# EAGLE design trololo (EAGLE 6.5.0)
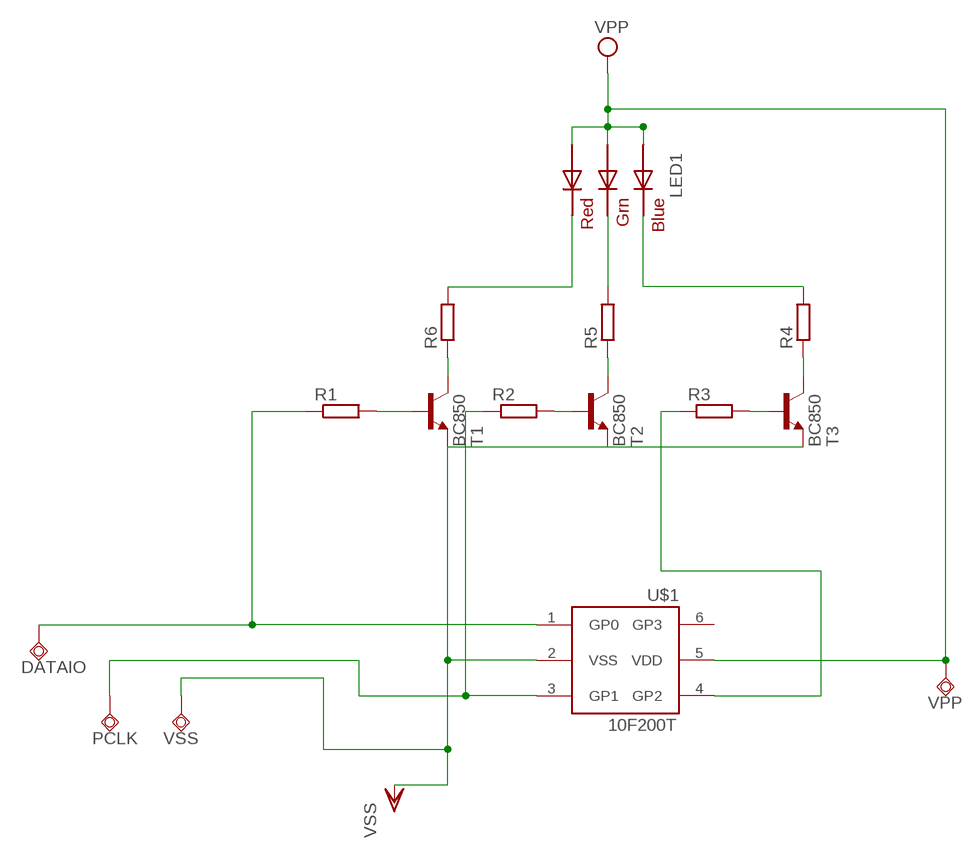
[diagram p0: schematic, sheet 1]

## Parts
DATAIO  TPSQPAD1-20Y  [P1-20Y]
LED1  RGBLED5050  [RGBLED5050]
PCLK  TPSQPAD1-20Y  [P1-20Y]
R1  R-EU_R0805  [R0805]
R2  R-EU_R0805  [R0805]
R3  R-EU_R0805  [R0805]
R4  R-EU_R0805  [R0805]
R5  R-EU_R0805  [R0805]
R6  R-EU_R0805  [R0805]
T1  BC850  [SOT23]
T2  BC850  [SOT23]
T3  BC850  [SOT23]
U$1  10F200T  [SOT23-6]
VPP  TPSQPAD1-20Y  [P1-20Y]
VSS  TPSQPAD1-20Y  [P1-20Y]

## Nets
N$1: R5.1 T2.3(C)
N$2: R4.1 T3.3(C)
N$3: R6.1 T1.3(C)
N$4: R1.2 T1.1(B)
N$5: R2.2 T2.1(B)
N$6: R3.2 T3.1(B)
N$7: DATAIO.TP R1.1 U$1.1(GP0)
N$8: PCLK.TP R2.1 U$1.3(GP1)
N$9: R3.1 U$1.4(GP2)
N$10: LED1.5(RED_C) R6.2
N$11: LED1.6(GREEN_C) R5.2
N$12: LED1.4(BLUE_C) R4.2
VPP: LED1.1(GREEN_A) LED1.2(RED_A) LED1.3(BLUE_A) U$1.5(VDD) VPP.TP
VSS: T1.2(E) T2.2(E) T3.2(E) U$1.2(VSS) VSS.TP
Unconnected: U$1.6(GP3)

## Library data of the parts
DATAIO PCLK VPP VSS = testpad:TPSQ: Test pad
LED1 = adafruit:RGBLED: For 5050 RGB LEDs, the order of the LEDs may vary from one manufacturer to another!
R1-R6 = rcl:R-EU_: RESISTOR, European symbol
T1-T3 = mbed-discrete:BC850: NPN TRANSISTOR
U$1 = adafruit:10F200T: PIC10F200/202/204/206 Ultra-small 8-bit PIC micros in SOT-23-6 and SOIC

## Board
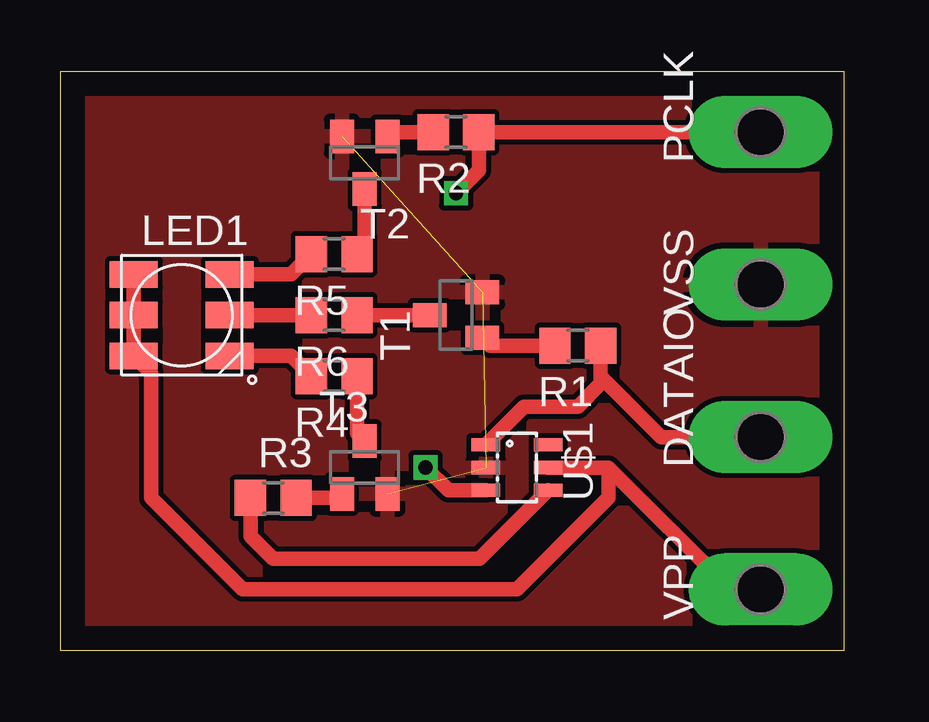
[diagram p1: board, top side]
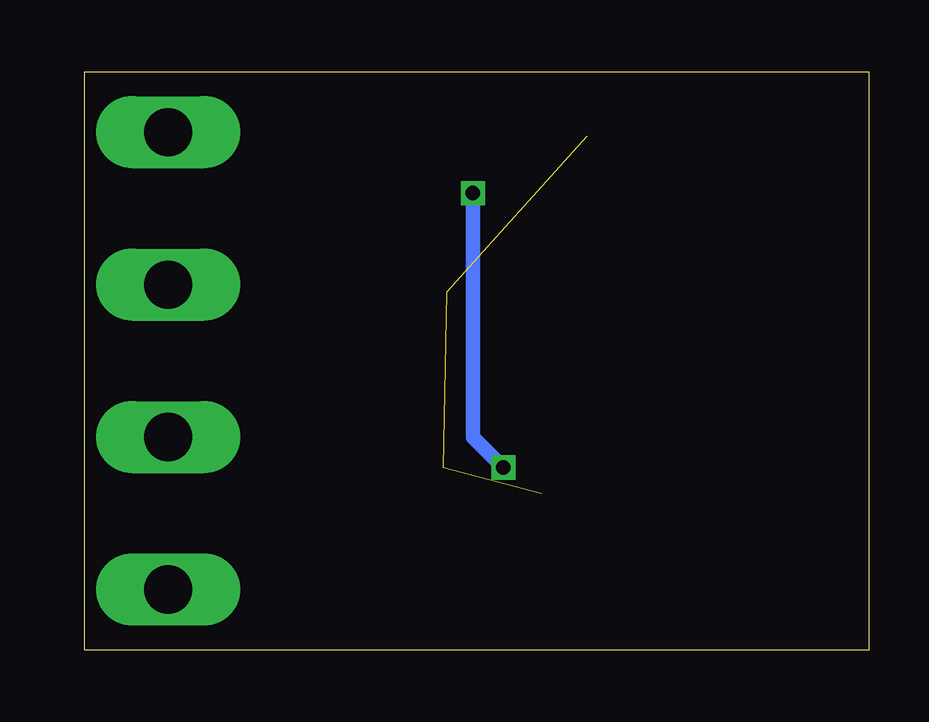
[diagram p2: board, bottom side, seen from below]

Size 32.69 x 24.12 mm. Coordinates in mm from the lower left corner, seen from the top.
Outline: 0,0 32.69,0 32.69,24.12 0,24.12 0,0
Copper layers (1*16): Top 0.035mm / dielectric 1.5mm / Bottom 0.035mm
Design rules "default": minimum track width 10mil, minimum drill 24mil, track to track 8mil, track to pad 8mil, pad to pad 8mil, via to via 8mil, smd to smd 8mil, copper to edge 40mil, drill to drill 8mil, minimum pad ring 10mil, minimum via ring 8mil, stop-mask expansion 4mil, vias tented up to drill 0mil, thermal gap 10mil

### Footprints (pad centres in the part's own frame; a part is rotated, then mirrored left to right if it is on the bottom)
P1-20Y = drill 2.007 pad 2.54 long: TP 0,0
RGBLED5050 = smd 2 x 1.1: 1 -2,1.7; 2 -2,0; 3 -2,-1.7; 4 2,-1.7; 5 2,0; 6 2,1.7
R0805 = smd 1.3 x 1.5: 1 -0.95,0; 2 0.95,0
SOT23 = smd 1 x 1.4: 1 -0.95,-1.1; 2 0.95,-1.1; 3 0,1.1
SOT23-6 = smd 0.55 x 1.2: 1 -0.95,-1.3; 2 0,-1.3; 3 0.95,-1.3; 4 0.95,1.3; 5 0,1.3; 6 -0.95,1.3

### Placement (x,y rotation side)
DATAIO  29.21,8.89 90 top
LED1  5.08,13.97 0 top
PCLK  29.21,21.59 90 top
R1  21.59,12.7 180 top
R2  16.51,21.59 180 top
R3  8.89,6.35 0 top
R4  11.43,11.43 180 top
R5  11.43,16.51 180 top
R6  11.43,13.97 180 top
T1  16.51,13.97 90 top
T2  12.7,20.32 180 top
T3  12.7,7.62 0 top
U$1  19.05,7.62 270 top
VPP  29.21,2.54 90 top
VSS  29.21,15.24 90 top

### Tracks (layer width: path | path; a pad name or v marks a point on that pad's centre or on a via)
N$1
  Top 0.61: T2.3 12.7,16.83 R5.1
N$2
  Top 0.61: R4.1 12.38,9.04 T3.3
N$3
  Top 0.61: R6.1 T1.3
N$4
  Top 0.61: R1.2 17.93,12.7 T1.1
N$5
  Top 0.61: R2.2 13.82,21.59 T2.1
N$6
  Top 0.61: R3.2 11.58,6.35 T3.1
N$7
  Top 0.61: R1.1 22.54,11.43 | 22.54,11.43 22.54,11.11 21.59,10.16 19.34,10.16 U$1.1 | DATAIO.TP 25.08,8.89 22.54,11.43
N$8  (via drill 0.6)
  Top 0.61: PCLK.TP R2.1 17.46,20 v16.51,19.05 | U$1.3 16.19,6.67 v15.24,7.62
  Bottom 0.61: v15.24,7.62 16.51,8.89 v16.51,19.05
N$9
  Top 0.61: R3.1 7.94,4.76 8.89,3.81 17.49,3.81 U$1.4
N$10
  Top 0.61: LED1.5 R6.2
N$11
  Top 0.61: LED1.6 9.64,15.67 R5.2
N$12
  Top 0.61: LED1.4 9.64,12.27 R4.2
VPP
  Top 0.61: LED1.1 LED1.2 LED1.3 3.81,11.54 3.81,6.35 7.62,2.54 19.05,2.54 22.86,6.35 22.86,7.62 | VPP.TP 27.94,2.54 22.86,7.62 | U$1.5 22.86,7.62
VSS  (3 unrouted)
  pour Top: -1.27,25.4 34.29,25.4 34.29,-1.27 -1.27,-1.27